# Altium project PPS_V2.PrjPcb
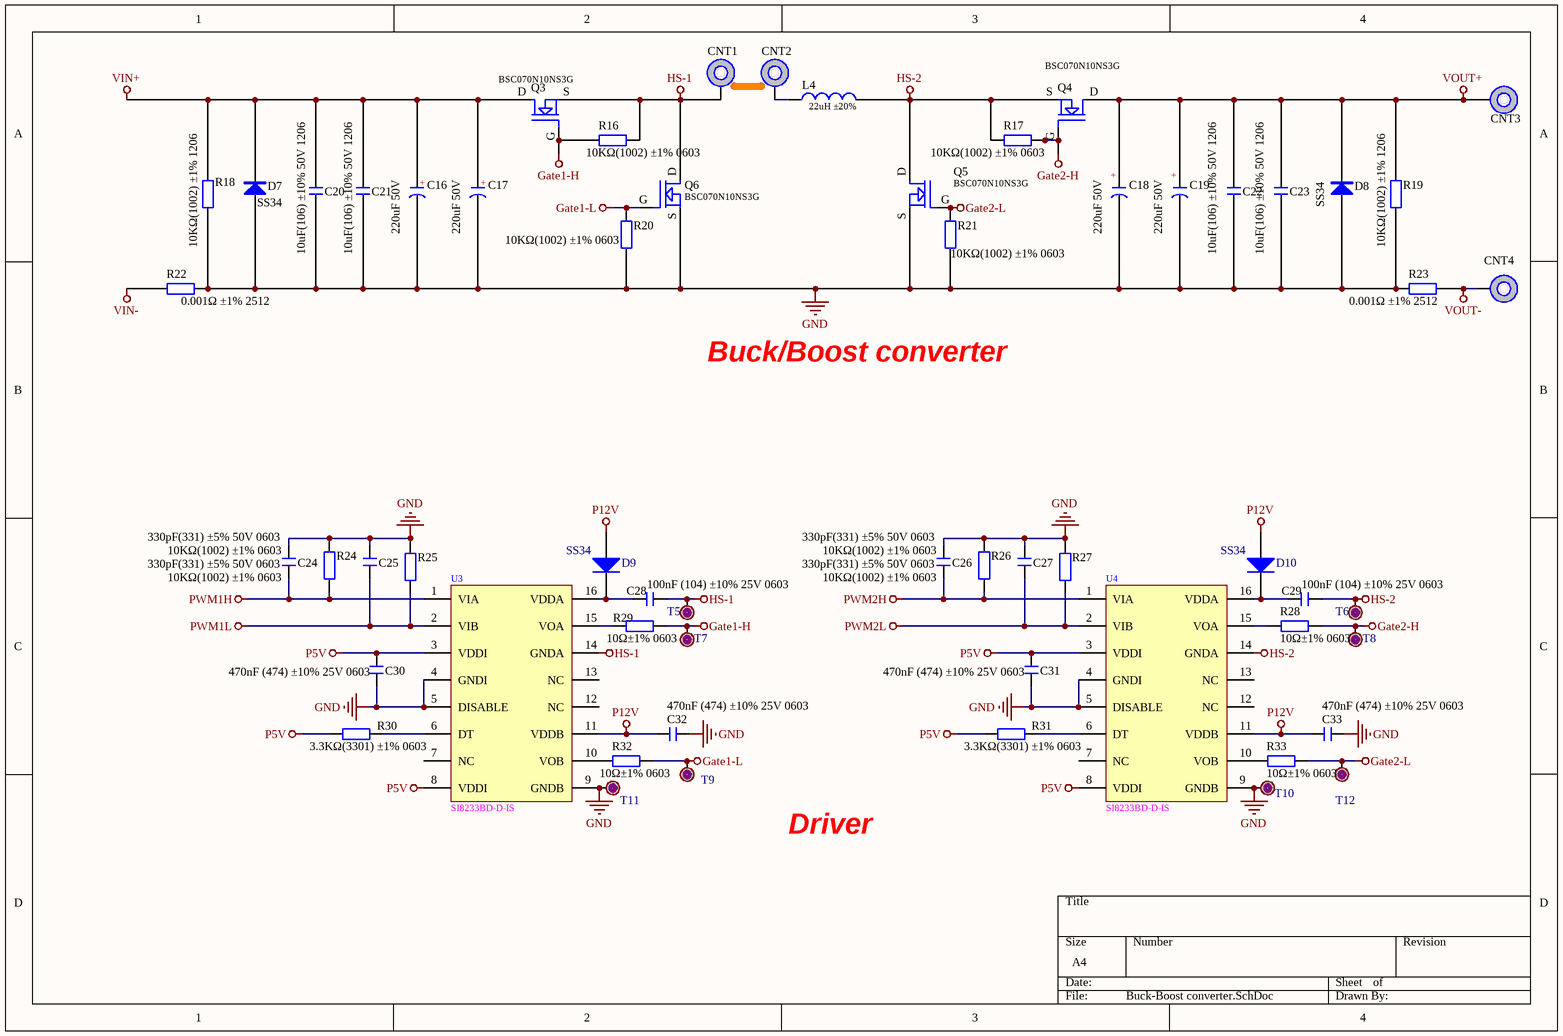
[diagram p0: Buck-Boost converter.SchDoc]
4 sheets, 172 parts. Net scope: global (net labels, ports and power ports of the same name join across sheets).
Sheets:
  Buck-Boost converter.SchDoc
  Power management.SchDoc
  Sampling.SchDoc
  Control.SchDoc

## Sheet Buck-Boost converter.SchDoc
size A4; SheetNumber: 1; SheetTotal: 4

### Parts
C16  220uF 50V  [CE F(10*10.2)]
C17  220uF 50V  [CE F(10*10.2)]
C18  220uF 50V  [CE F(10*10.2)]
C19  220uF 50V  [CE F(10*10.2)]
C20  10uF(106) ±10% 50V 1206  [C 1206_M]
C21  10uF(106) ±10% 50V 1206  [C 1206_M]
C22  10uF(106) ±10% 50V 1206  [C 1206_M]
C23  10uF(106) ±10% 50V 1206  [C 1206_M]
C24  330pF(331) ±5% 50V 0603  [C 0603_L]
C25  330pF(331) ±5% 50V 0603  [C 0603_L]
C26  330pF(331) ±5% 50V 0603  [C 0603_L]
C27  330pF(331) ±5% 50V 0603  [C 0603_L]
C28  100nF (104) ±10% 25V 0603  [C 0603_L]
C29  100nF (104) ±10% 25V 0603  [C 0603_L]
C30  470nF (474) ±10% 25V 0603  [C 0603_L]
C31  470nF (474) ±10% 25V 0603  [C 0603_L]
C32  470nF (474) ±10% 25V 0603  [C 0603_L]
C33  470nF (474) ±10% 25V 0603  [C 0603_L]
CNT1  CST  [M3]  (value not drawn)
CNT2  CST  [M3]  (value not drawn)
CNT3  CST  [M3]  (value not drawn)
CNT4  CST  [M3]  (value not drawn)
D7  SS34  [SMA]
D8  SS34  [SMA]
D9  SS34  [SMA]
D10  SS34  [SMA]
L4  22uH ±20%  [L-SMD-0630]
Q3  BSC070N10NS3G  [PG-TDSON-8_5x6MM]
Q4  BSC070N10NS3G  [PG-TDSON-8_5x6MM]
Q5  BSC070N10NS3G  [PG-TDSON-8_5x6MM]
Q6  BSC070N10NS3G  [PG-TDSON-8_5x6MM]
R16  10KΩ(1002) ±1% 0603  [R 0603_L]
R17  10KΩ(1002) ±1% 0603  [R 0603_L]
R18  10KΩ(1002) ±1% 1206  [R 1206_L]
R19  10KΩ(1002) ±1% 1206  [R 1206_L]
R20  10KΩ(1002) ±1% 0603  [R 0603_L]
R21  10KΩ(1002) ±1% 0603  [R 0603_L]
R22  0.001Ω ±1% 2512  [R2512]
R23  0.001Ω ±1% 2512  [R2512]
R24  10KΩ(1002) ±1% 0603  [R 0603_L]
R25  10KΩ(1002) ±1% 0603  [R 0603_L]
R26  10KΩ(1002) ±1% 0603  [R0805_L]
R27  10KΩ(1002) ±1% 0603  [R 0603_L]
R28  10Ω±1% 0603  [R 0603_L]
R29  10Ω±1% 0603  [R 0603_L]
R30  3.3KΩ(3301) ±1% 0603  [R 0603_L]
R31  3.3KΩ(3301) ±1% 0603  [R 0603_L]
R32  10Ω±1% 0603  [R 0603_L]
R33  10Ω±1% 0603  [R 0603_L]
T5  TestP  [TestP]  (value not drawn)
T6  TestP  [TestP]  (value not drawn)
T7  TestP  [TestP]  (value not drawn)
T8  TestP  [TestP]  (value not drawn)
T9  TestP  [TestP]  (value not drawn)
T10  TestP  [TestP]  (value not drawn)
T11  TestP  [TestP]  (value not drawn)
T12  TestP  [TestP]  (value not drawn)
U3  SI8233BD-D-IS  [SOJ16T]
U4  SI8233BD-D-IS  [SOJ16T]

### Nets
Gate1-H: Q3.G(GATE) R16.1 R29.1 T7.0
Gate1-L: Q6.G(GATE) R20.2 R32.1 T9.0
Gate2-H: Q4.G(GATE) R17.1 R28.1 T8.0
Gate2-L: Q5.G(GATE) R21.2 R33.1 T12.0
GND: C16.2(K) C17.2(K) C18.2(K) C19.2(K) C20.1 C21.1 C22.1 C23.1 C24.2 C25.2 C26.2 C27.2 C30.2 C31.2 C32.1 C33.1 D7.1(A) D8.1(A) Q5.S(SOURCE) Q6.S(SOURCE) R18.1 R19.1 R20.1 R21.1 R22.1 R23.1 R24.2 R25.2 R26.2 R27.2 T10.0 T11.0 U3.4(GNDI) U3.5(DISABLE) U3.9(GNDB) U4.4(GNDI) U4.5(DISABLE) U4.9(GNDB)
HS-1: C28.2 CNT1.1 Q3.S(SOURCE) Q6.D(DRAIN) R16.2 T5.0 U3.14(GNDA)
HS-2: C29.2 L4.2 Q4.S(SOURCE) Q5.D(DRAIN) R17.2 T6.0 U4.14(GNDA)
P5V: C30.1 C31.1 R30.2 R31.2 U3.3(VDDI) U3.8(VDDI) U4.3(VDDI) U4.8(VDDI)
P12V: C32.2 C33.2 D9.1(A) D10.1(A) U3.11(VDDB) U4.11(VDDB)
PWM1H: C24.1 R24.1 U3.1(VIA)
PWM1L: C25.1 R25.1 U3.2(VIB)
PWM2H: C26.1 R26.1 U4.1(VIA)
PWM2L: C27.1 R27.1 U4.2(VIB)
VIN+: C16.1(A) C17.1(A) C20.2 C21.2 D7.2(K) Q3.D(DRAIN) R18.2
VIN-: R22.2
VOUT+: C18.1(A) C19.1(A) C22.2 C23.2 CNT3.1 D8.2(K) Q4.D(DRAIN) R19.2
VOUT-: CNT4.1 R23.2
NetC28_1: C28.1 D9.2(K) U3.16(VDDA)
NetC29_1: C29.1 D10.2(K) U4.16(VDDA)
NetCNT2_1: CNT2.1 L4.1
NetR28_2: R28.2 U4.15(VOA)
NetR29_2: R29.2 U3.15(VOA)
NetR30_1: R30.1 U3.6(DT)
NetR31_1: R31.1 U4.6(DT)
NetR32_2: R32.2 U3.10(VOB)
NetR33_2: R33.2 U4.10(VOB)

Not connected (* = marked no-connect by the designer): U3 7(NC) 12(NC) 13(NC); U4 7(NC) 12(NC) 13(NC)

### Notes on the sheet
- Buck/Boost converter
- Driver
- (in symbol CE) +

### Library data of the parts
C16-C19 = CE: 直插电解电容
C20-C33 = C: 贴片电容; BOM名称: 无极性贴片电容; 淘宝ID: 封装库来自淘宝 ID：黄晶宝石; 联系售后，技术支持: https://shop463601444.taobao.com; 唯一出售店铺网址: https://shop463601444.taobao.com
CNT1-CNT4 = SO3040
D7 D8 = 1N4007: 整流二极管; 淘宝ID: 封装库来自淘宝 ID：黄晶宝石; 封装库来自淘宝卖家 ID：黄晶宝石: 其他店铺购入均为盗版，不享受售后技术支持服务，请立即申请退款; BOM名称: 整流二极管; 联系售后，技术支持: https://shop463601444.taobao.com
D9 D10 = Diode: Default Diode
L4 = Inductor
Q3-Q6 = MOSFET N
R16-R33 = R: 贴片电阻; 版权归属: 来自淘宝 ID：黄晶宝石; 封装库来自淘宝卖家 ID：黄晶宝石: 其他店铺购入均为盗版，不享受售后技术支持服务，请立即申请退款; BOM名称: 贴片电阻; 联系售后: https://shop463601444.taobao.com
U3 U4 = Si8233

## Sheet Power management.SchDoc
size A4; SheetNumber: 2; SheetTotal: 4
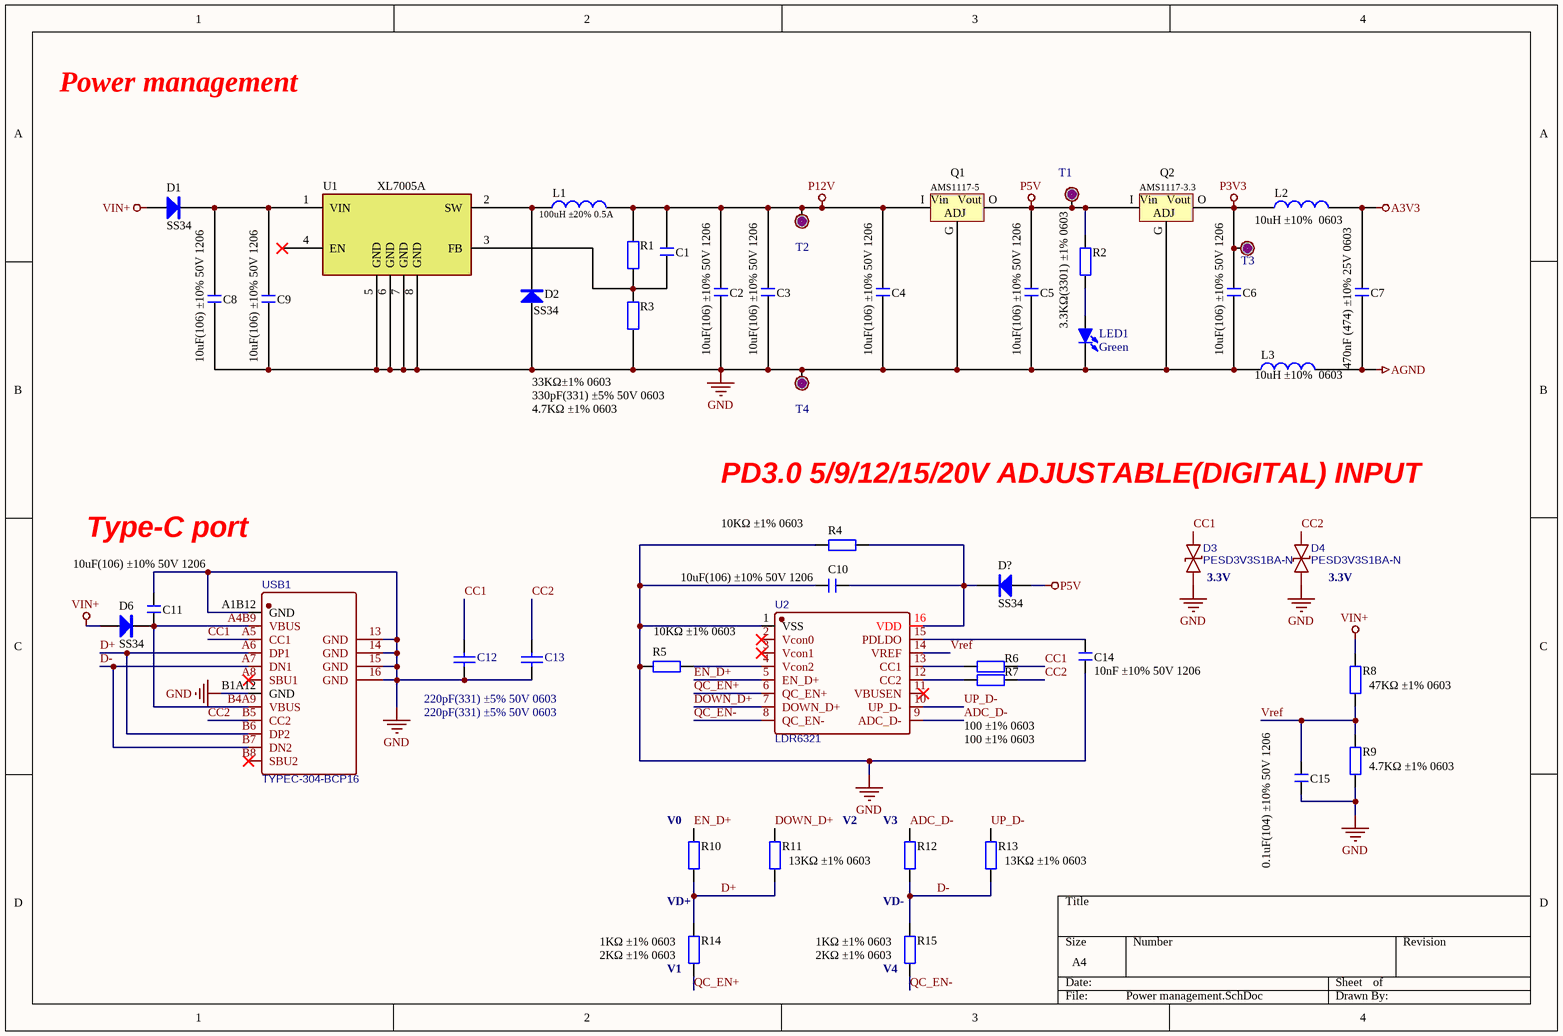
[diagram p1: Power management.SchDoc]

### Parts
C1  330pF(331) ±5% 50V 0603  [C 0603_L]
C2  10uF(106) ±10% 50V 1206  [C 1206_M]
C3  10uF(106) ±10% 50V 1206  [C 1206_M]
C4  10uF(106) ±10% 50V 1206  [C 1206_M]
C5  10uF(106) ±10% 50V 1206  [C 1206_M]
C6  10uF(106) ±10% 50V 1206  [C 1206_M]
C7  470nF (474) ±10% 25V 0603  [C 0603_L]
C8  10uF(106) ±10% 50V 1206  [C 1206_M]
C9  10uF(106) ±10% 50V 1206  [C 1206_M]
C10  10uF(106) ±10% 50V 1206  [C 1206_M]
C11  10uF(106) ±10% 50V 1206  [C 1206_M]
C12  220pF(331) ±5% 50V 0603  [C0603_L]
C13  220pF(331) ±5% 50V 0603  [C0603_L]
C14  10nF ±10% 50V 1206  [C 1206_M]
C15  0.1uF(104) ±10% 50V 1206  [C 1206_M]
D1  SS34  [SMA]
D2  SS34  [SMA]
D3  PESD3V3S1BA-N  [SOD-523_L1.2-W0.8-LS1.6-BI]
D4  PESD3V3S1BA-N  [SOD-523_L1.2-W0.8-LS1.6-BI]
D6  SS34  [SMA]
D?  SS34  [SMA]
L1  100uH ±20% 0.5A  [CDRH74]
L2  10uH ±10%  0603  [L 0603]
L3  10uH ±10%  0603  [L 0603]
LED1  Green  [LED 0603R]
Q1  AMS1117-5  [SOT-223]
Q2  AMS1117-3.3  [SOT-223]
R1  33KΩ±1% 0603  [R 0603_L]
R2  3.3KΩ(3301) ±1% 0603  [R 0603_L]
R3  4.7KΩ ±1% 0603  [R 0603_L]
R4  10KΩ ±1% 0603  [R 0603_L]
R5  10KΩ ±1% 0603  [R 0603_L]
R6  100 ±1% 0603  [R 0603_L]
R7  100 ±1% 0603  [R 0603_L]
R8  47KΩ ±1% 0603  [R 0603_L]
R9  4.7KΩ ±1% 0603  [R 0603_L]
R10  1KΩ ±1% 0603  [R 0603_L]
R11  13KΩ ±1% 0603  [R 0603_L]
R12  1KΩ ±1% 0603  [R 0603_L]
R13  13KΩ ±1% 0603  [R 0603_L]
R14  2KΩ ±1% 0603  [R 0603_L]
R15  2KΩ ±1% 0603  [R 0603_L]
T1  TestP  [TestP]  (value not drawn)
T2  TestP  [TestP]  (value not drawn)
T3  TestP  [TestP]  (value not drawn)
T4  TestP  [TestP]  (value not drawn)
U1  XL7005A  [SOP8-EP]
U2  LDR6321  [SSOP-16_L5.0-W4.4-P0.65-LS6.4-BL]
USB1  TYPEC-304-BCP16  [USB-C-SMD_TYPEC-304-BCP16]

### Nets
A3V3: C7.1 L2.2
AGND: C7.2 L3.2
GND: C2.1 C3.1 C4.1 C5.1 C6.1 C8.1 C9.1 C10.2 C11.2 C12.1 C13.1 C14.1 C15.1 D2.1(A) D3.1 D4.1 L3.1 LED1.2(K) Q1.G Q2.G R3.2 R4.1 R5.1 R9.1 T4.0 U1.5(GND) U1.6(GND) U1.7(GND) U1.8(GND) U2.1(VSS) USB1.13(GND) USB1.14(GND) USB1.15(GND) USB1.16(GND) USB1.A1B12(GND) USB1.B1A12(GND)
P3V3: C6.2 L2.1 Q2.O(OUT) T3.0
P5V: C5.2 D?.1(A) Q1.O(OUT) Q2.I(IN) R2.1 T1.0
P12V: C1.2 C2.2 C3.2 C4.2 L1.2 Q1.I(IN) R1.1 T2.0
VIN+: D1.1(A) D6.1(A) R8.2
ADC_D-: R12.2 U2.9(ADC_D-)
CC1: C12.2 D3.2 R6.2 USB1.A5(CC1)
CC2: C13.2 D4.2 R7.2 USB1.B5(CC2)
D+: R10.1 R11.1 R14.2 USB1.A6(DP1) USB1.B6(DP2)
D-: R12.1 R13.1 R15.2 USB1.A7(DN1) USB1.B7(DN2)
DOWN_D+: R11.2 U2.7(DOWN_D+)
EN_D+: R10.2 U2.5(EN_D+)
QC_EN+: R14.1 U2.6(QC_EN+)
QC_EN-: R15.1 U2.8(QC_EN-)
UP_D-: R13.2 U2.10(UP_D-)
Vref: C15.2 R8.1 R9.2 U2.14(VREF)
NetC1_1: C1.1 R1.2 R3.1 U1.3(FB)
NetC8_2: C8.2 C9.2 D1.2(K) U1.1(VIN)
NetC10_1: C10.1 D?.2(K) R4.2 U2.16(VDD)
NetC11_1: C11.1 D6.2(K) USB1.A4B9(VBUS) USB1.B4A9(VBUS)
NetC14_2: C14.2 U2.15(PDLDO)
NetD2_2: D2.2(K) L1.1 U1.2(SW)
NetLED1_1: LED1.1(A) R2.2
NetR5_2: R5.2 U2.4(Vcon2)
NetR6_1: R6.1 U2.13(CC1)
NetR7_1: R7.1 U2.12(CC2)

Not connected (* = marked no-connect by the designer): U1 4(EN)*; U2 2(Vcon0)* 3(Vcon1)* 11(VBUSEN)*; USB1 A8(SBU1)* B8(SBU2)*

### Notes on the sheet
- Power management
- PD3.0 5/9/12/15/20V ADJUSTABLE(DIGITAL) INPUT
- Type-C port
- (near D3) 3.3V
- (near D4) 3.3V
- (near R10) V0
- V2
- (near R12) V3
- VD+
- VD-
- (near R14) V1
- (near R15) V4
- (in symbol NCP1117ST50T3G) Vin; Vout; ADJ

### Library data of the parts
C1-C11 C14 C15 = C: as C20 on sheet Buck-Boost converter; 联系售后，技术支持: https://shop463601444.taobao.com; 唯一出售店铺网址: https://shop463601444.taobao.com
C12 C13 = C: 贴片电容/MLCC电容; BOM名称: 无极性贴片电容; 联系卖家，免费查找封装: 唯一出售店铺网址https://shop463601444.taobao.com
D1 D2 D6 D? = 1N4007: as D7 on sheet Buck-Boost converter; BOM名称: 整流二极管; 联系售后，技术支持: https://shop463601444.taobao.com
D3 D4 = PESD3V3S1BA-N: TVS3V3; BOM_Manufacturer: Bourne Semicon (Shenzhen); Contributor: LCSC; BOM_Supplier: LCSC; BOM_Supplier Part: C316037; BOM_Manufacturer Part: PESD3V3S1BA-N; BOM_JLCPCB Part Class: Extended Part; spicePre: D; spiceSymbolName: PESD3V3S1BA-N
L1 = Inductor
L2 L3 = L: 小功率贴片电感; 淘宝ID: 封装库来自淘宝 ID：黄晶宝石; 封装库来自淘宝卖家 ID：黄晶宝石: 其他店铺购入均为盗版，不享受售后技术支持服务，请立即申请退款; BOM名称: 小功率贴片电感; 联系售后: https://shop463601444.taobao.com
LED1 = LED-SMD: 贴片LED; 版权归属: 封装库来自淘宝 ID：黄晶宝石; BOM名称: 贴片LED; 学习资源: https://shop463601444.taobao.com
Q1 Q2 = NCP1117ST50T3G
R1-R15 = R: as R16 on sheet Buck-Boost converter; BOM名称: 贴片电阻; 联系售后: https://shop463601444.taobao.com
U2 = LDR6321: BOM_Manufacturer: Legendary(乐得瑞); Contributor: LCSC; BOM_Supplier: LCSC; BOM_Supplier Part: C2919632; BOM_Manufacturer Part: LDR6321; BOM_JLCPCB Part Class: Extended Part; spicePre: U; spiceSymbolName: LDR6321
USB1 = TYPEC-304-BCP16: BOM_Manufacturer: XUNPU; Contributor: LCSC; BOM_Supplier: LCSC; BOM_Supplier Part: C720629; BOM_Manufacturer Part: TYPEC-304-BCP16; BOM_JLCPCB Part Class: Extended Part; spicePre: U; spiceSymbolName: TYPEC-304-BCP16

## Sheet Sampling.SchDoc
size A4; SheetNumber: 2; SheetTotal: 3
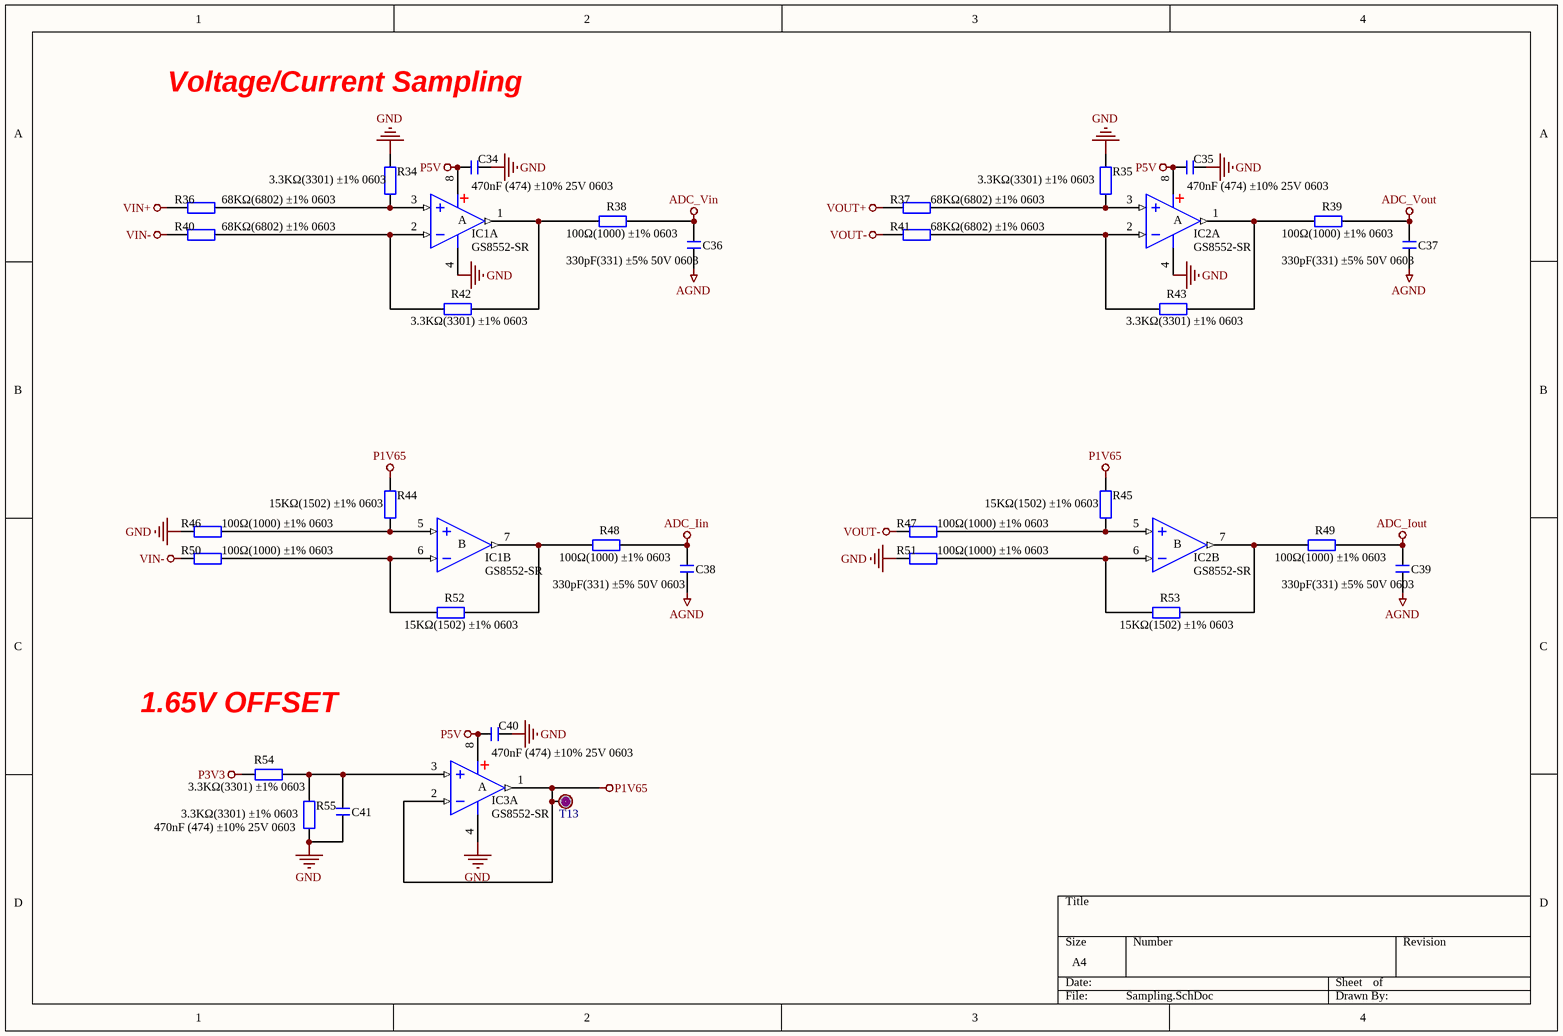
[diagram p2: Sampling.SchDoc]

### Parts
C34  470nF (474) ±10% 25V 0603  [C 0603_L]
C35  470nF (474) ±10% 25V 0603  [C 0603_L]
C36  330pF(331) ±5% 50V 0603  [C 0603_L]
C37  330pF(331) ±5% 50V 0603  [C 0603_L]
C38  330pF(331) ±5% 50V 0603  [C 0603_L]
C39  330pF(331) ±5% 50V 0603  [C 0603_L]
C40  470nF (474) ±10% 25V 0603  [C 0603_L]
C41  470nF (474) ±10% 25V 0603  [C 0603_L]
IC1  GS8552-SR  [SOP8_N]  (parts A,B of 2)
IC2  GS8552-SR  [SOP8_N]  (parts A,B of 2)
IC3  GS8552-SR  [SOP8_N]  (part A of 2)
R34  3.3KΩ(3301) ±1% 0603  [R 0603_L]
R35  3.3KΩ(3301) ±1% 0603  [R 0603_L]
R36  68KΩ(6802) ±1% 0603  [R 0603_L]
R37  68KΩ(6802) ±1% 0603  [R 0603_L]
R38  100Ω(1000) ±1% 0603  [R 0603_L]
R39  100Ω(1000) ±1% 0603  [R 0603_L]
R40  68KΩ(6802) ±1% 0603  [R 0603_L]
R41  68KΩ(6802) ±1% 0603  [R 0603_L]
R42  3.3KΩ(3301) ±1% 0603  [R 0603_L]
R43  3.3KΩ(3301) ±1% 0603  [R 0603_L]
R44  15KΩ(1502) ±1% 0603  [R 0603_L]
R45  15KΩ(1502) ±1% 0603  [R 0603_L]
R46  100Ω(1000) ±1% 0603  [R 0603_L]
R47  100Ω(1000) ±1% 0603  [R 0603_L]
R48  100Ω(1000) ±1% 0603  [R 0603_L]
R49  100Ω(1000) ±1% 0603  [R 0603_L]
R50  100Ω(1000) ±1% 0603  [R 0603_L]
R51  100Ω(1000) ±1% 0603  [R 0603_L]
R52  15KΩ(1502) ±1% 0603  [R 0603_L]
R53  15KΩ(1502) ±1% 0603  [R 0603_L]
R54  3.3KΩ(3301) ±1% 0603  [R 0603_L]
R55  3.3KΩ(3301) ±1% 0603  [R 0603_L]
T13  TestP  [TestP]  (value not drawn)

### Nets
ADC_Iin: C38.2 R48.2
ADC_Iout: C39.2 R49.2
ADC_Vin: C36.2 R38.2
ADC_Vout: C37.2 R39.2
AGND: C36.1 C37.1 C38.1 C39.1
GND: C34.1 C35.1 C40.1 C41.2 IC1.4(V-) IC2.4(V-) IC3.4(V-) R34.2 R35.2 R46.1 R51.1 R55.2
P1V65: IC3.1(OUT) IC3.2(IN-) R44.2 R45.2 T13.0
P3V3: R54.2
P5V: C34.2 C35.2 C40.2 IC1.8(V+) IC2.8(V+) IC3.8(V+)
VIN+: R36.1
VIN-: R40.1 R50.1
VOUT+: R37.1
VOUT-: R41.1 R47.1
NetC41_1: C41.1 IC3.3(IN+) R54.1 R55.1
NetIC1_1: IC1.1(OUT) R38.1 R42.2
NetIC1_2: IC1.2(IN-) R40.2 R42.1
NetIC1_3: IC1.3(IN+) R34.1 R36.2
NetIC1_5: IC1.5(IN+) R44.1 R46.2
NetIC1_6: IC1.6(IN-) R50.2 R52.1
NetIC1_7: IC1.7(OUT) R48.1 R52.2
NetIC2_1: IC2.1(OUT) R39.1 R43.2
NetIC2_2: IC2.2(IN-) R41.2 R43.1
NetIC2_3: IC2.3(IN+) R35.1 R37.2
NetIC2_5: IC2.5(IN+) R45.1 R47.2
NetIC2_6: IC2.6(IN-) R51.2 R53.1
NetIC2_7: IC2.7(OUT) R49.1 R53.2

### Notes on the sheet
- Voltage/Current Sampling
- 1.65V OFFSET
- (in symbol LM358, part A) A
- (in symbol LM358, part B) B

### Library data of the parts
C34-C41 = C: as C20 on sheet Buck-Boost converter; 联系售后，技术支持: https://shop463601444.taobao.com; 唯一出售店铺网址: https://shop463601444.taobao.com
IC1-IC3 = LM358: 双路运放; 版权归属: 源创客; BOM名称: 双路运放; 封装库来自淘宝 ID：黄晶宝石: https://shop463601444.taobao.com
R34-R55 = R: as R16 on sheet Buck-Boost converter; BOM名称: 贴片电阻; 联系售后: https://shop463601444.taobao.com

## Sheet Control.SchDoc
size A4; SheetNumber: 4; SheetTotal: 4
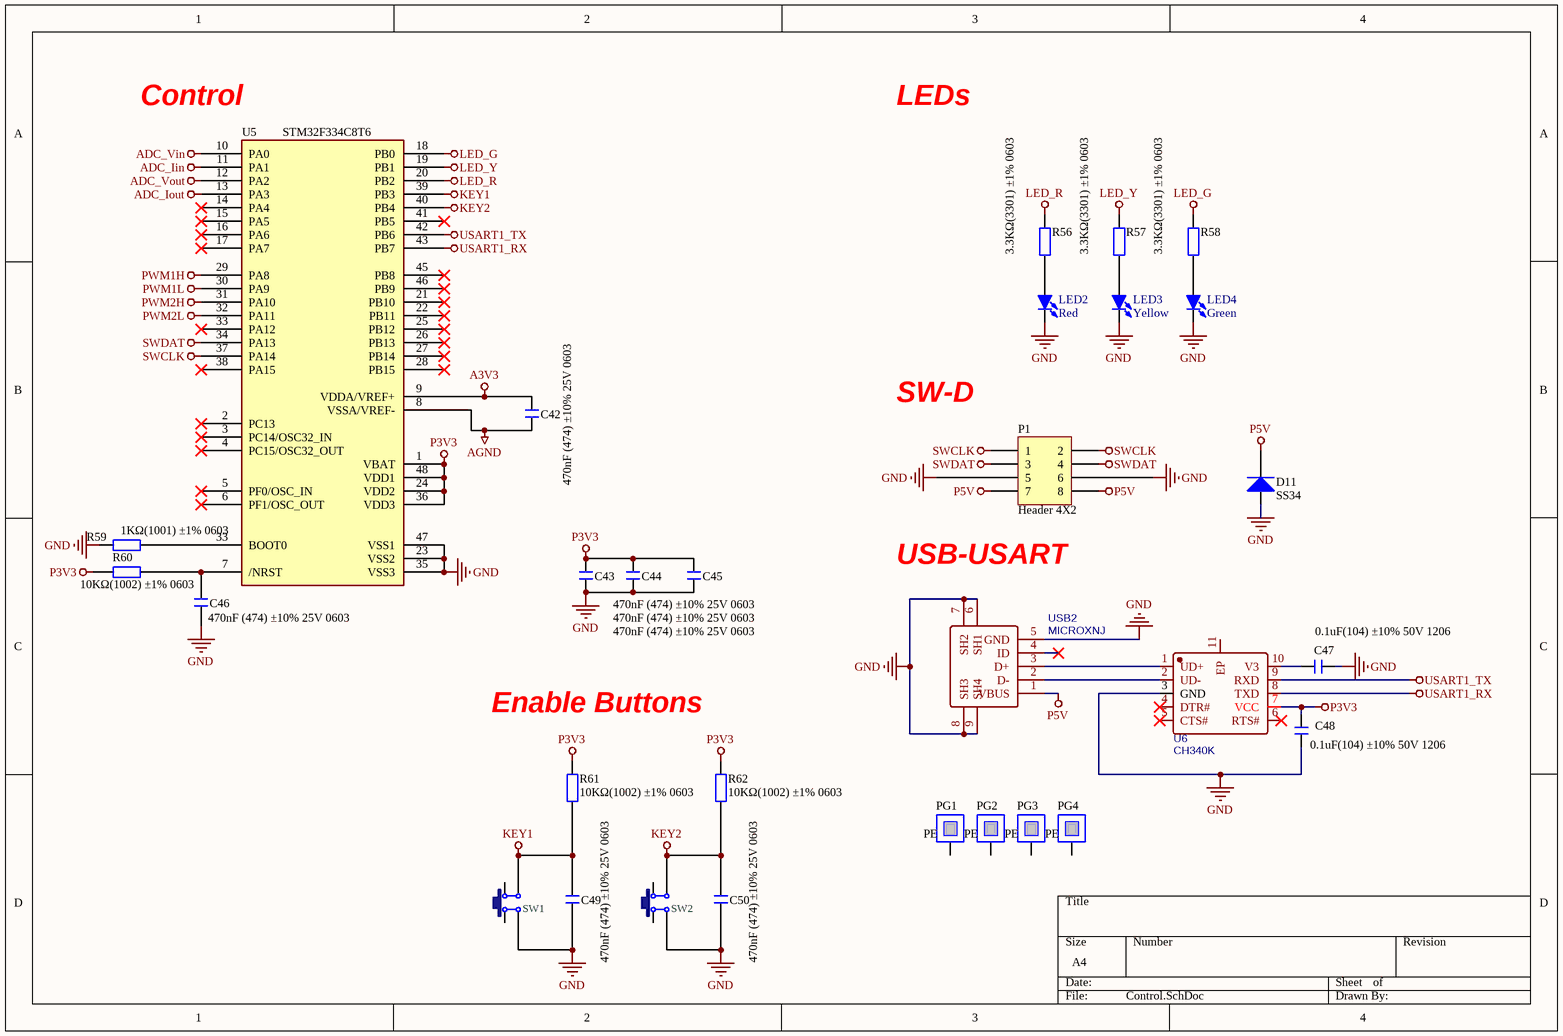
[diagram p3: Control.SchDoc]

### Parts
C42  470nF (474) ±10% 25V 0603  [C 0603_L]
C43  470nF (474) ±10% 25V 0603  [C 0603_L]
C44  470nF (474) ±10% 25V 0603  [C 0603_L]
C45  470nF (474) ±10% 25V 0603  [C 0603_L]
C46  470nF (474) ±10% 25V 0603  [C 0603_L]
C47  0.1uF(104) ±10% 50V 1206  [C 1206_M]
C48  0.1uF(104) ±10% 50V 1206  [C 1206_M]
C49  470nF (474) ±10% 25V 0603  [C 0603_L]
C50  470nF (474) ±10% 25V 0603  [C 0603_L]
D11  SS34  [SMA]
LED2  Red  [LED 0603R]
LED3  Yellow  [LED 0603R]
LED4  Green  [LED 0603R]
P1  Header 4X2  [HDR2.54-LI-2x4P]
PG1  PE  [FG-M3]  (no BOM)
PG2  PE  [FG-M3]  (no BOM)
PG3  PE  [FG-M3]  (no BOM)
PG4  PE  [FG-M3]  (no BOM)
R56  3.3KΩ(3301) ±1% 0603  [R 0603_L]
R57  3.3KΩ(3301) ±1% 0603  [R 0603_L]
R58  3.3KΩ(3301) ±1% 0603  [R 0603_L]
R59  1KΩ(1001) ±1% 0603  [R 0603_L]
R60  10KΩ(1002) ±1% 0603  [R 0603_L]
R61  10KΩ(1002) ±1% 0603  [R 0603_L]
R62  10KΩ(1002) ±1% 0603  [R 0603_L]
SW1  6x6x5  [TSW SMD-6*6*7]  (value not drawn)
SW2  6x6x5  [TSW SMD-6*6*7]  (value not drawn)
U5  STM32F334C8T6  [LQFP48-7*7]
U6  CH340K  [ESOP-10_L4.9-W3.9-P1.00-LS6.2-BL-EP]
USB2  MICROXNJ  [MICRO-USB-SMD_MICROXNJ]

### Nets
A3V3: C42.2 U5.9(VDDA/VREF+)
ADC_Iin: U5.11(PA1)
ADC_Iout: U5.13(PA3)
ADC_Vin: U5.10(PA0)
ADC_Vout: U5.12(PA2)
AGND: C42.1 U5.8(VSSA/VREF-)
GND: C43.1 C44.1 C45.1 C46.1 C47.1 C48.2 C49.1 C50.1 D11.1(A) LED2.2(K) LED3.2(K) LED4.2(K) P1.5 P1.6 R59.1 SW1.4 SW2.4 U5.23(VSS2) U5.35(VSS3) U5.47(VSS1) U6.3(GND) USB2.5(GND) USB2.6(SH1) USB2.7(SH2) USB2.8(SH3) USB2.9(SH4)
KEY1: C49.2 R61.1 SW1.3 U5.39(PB3)
KEY2: C50.2 R62.1 SW2.3 U5.40(PB4)
LED_G: R58.2 U5.18(PB0)
LED_R: R56.2 U5.20(PB2)
LED_Y: R57.2 U5.19(PB1)
P3V3: C43.2 C44.2 C45.2 C48.1 R60.1 R61.2 R62.2 U5.1(VBAT) U5.24(VDD2) U5.36(VDD3) U5.48(VDD1) U6.7(VCC)
P5V: D11.2(K) P1.7 P1.8 USB2.1(VBUS)
PWM1H: U5.29(PA8)
PWM1L: U5.30(PA9)
PWM2H: U5.31(PA10)
PWM2L: U5.32(PA11)
SWCLK: P1.1 P1.2 U5.37(PA14)
SWDAT: P1.3 P1.4 U5.34(PA13)
USART1_RX: U5.43(PB7) U6.8(TXD)
USART1_TX: U5.42(PB6) U6.9(RXD)
NetC46_2: C46.2 R60.2 U5.7(/NRST)
NetC47_2: C47.2 U6.10(V3)
NetLED2_1: LED2.1(A) R56.1
NetLED3_1: LED3.1(A) R57.1
NetLED4_1: LED4.1(A) R58.1
NetR59_2: R59.2 U5.33(PA12)
NetU6_1: U6.1(UD+) USB2.3(D+)
NetU6_2: U6.2(UD-) USB2.2(D-)

Not connected (* = marked no-connect by the designer): PG1 1; PG2 1; PG3 1; PG4 1; SW1 1 2; SW2 1 2; U5 2(PC13)* 3(PC14/OSC32_IN)* 4(PC15/OSC32_OUT)* 5(PF0/OSC_IN)* 6(PF1/OSC_OUT)* 14(PA4)* 15(PA5)* 16(PA6)* 17(PA7)* 21(PB10)* 22(PB11)* 25(PB12)* 26(PB13)* 27(PB14)* 28(PB15)* 38(PA15)* 41(PB5)* 45(PB8)* 46(PB9)*; U6 4(DTR#)* 5(CTS#)* 6(RTS#)* 11(EP); USB2 4(ID)*

### Notes on the sheet
- (near U5) Control
- LEDs
- SW-D
- USB-USART
- Enable Buttons

### Library data of the parts
C42-C50 = C: as C20 on sheet Buck-Boost converter; 联系售后，技术支持: https://shop463601444.taobao.com; 唯一出售店铺网址: https://shop463601444.taobao.com
D11 = Diode: Default Diode
LED2-LED4 = LED-SMD: 贴片LED; 版权归属: 封装库来自淘宝 ID：黄晶宝石; BOM名称: 贴片LED; 学习资源: https://shop463601444.taobao.com
P1 = Header 4X2: Header, 4-Pin, Dual row; LatestRevisionDate: 17-Jul-2002; LatestRevisionNote: Re-released for DXP Platform.; Publisher: Altium Limited
PG1-PG4 = H-SINK
R56-R62 = R: as R16 on sheet Buck-Boost converter; BOM名称: 贴片电阻; 联系售后: https://shop463601444.taobao.com
SW1 SW2 = TSW DIP-6x6: 直插6x6轻触开关; 版权归属: 封装库来自淘宝 ID：黄晶宝石; BOM名称: 直插6x6轻触开关; 唯一出售店铺网址: https://shop463601444.taobao.com
U6 = CH340K: BOM_Manufacturer: WCH(Jiangsu Qin Heng); Contributor: LCSC; BOM_Supplier: LCSC; BOM_Supplier Part: C968586; BOM_Manufacturer Part: CH340K; BOM_JLCPCB Part Class: Extended Part; spicePre: U; spiceSymbolName: CH340K
USB2 = MICROXNJ: BOM_Manufacturer: SHOU HAN; Contributor: LCSC; BOM_Supplier: LCSC; BOM_Supplier Part: C404969; BOM_Manufacturer Part: MicroXNJ; BOM_JLCPCB Part Class: Extended Part; spicePre: U; spiceSymbolName: MICROXNJ

## Nets that join several sheets
A3V3: Power management (C7.1 L2.2), Control (C42.2 U5.9)
ADC_Iin: Sampling (C38.2 R48.2), Control (U5.11)
ADC_Iout: Sampling (C39.2 R49.2), Control (U5.13)
ADC_Vin: Sampling (C36.2 R38.2), Control (U5.10)
ADC_Vout: Sampling (C37.2 R39.2), Control (U5.12)
AGND: Power management (C7.2 L3.2), Sampling (C36.1 C37.1 C38.1 C39.1), Control (C42.1 U5.8)
GND: Buck-Boost converter (38 pins), Power management (36 pins), Sampling (12 pins), Control (26 pins)
P3V3: Power management (C6.2 L2.1 Q2.O T3.0), Sampling (R54.2), Control (12 pins)
P5V: Buck-Boost converter (8 pins), Power management (6 pins), Sampling (6 pins), Control (D11.2 P1.7 P1.8 USB2.1)
P12V: Buck-Boost converter (6 pins), Power management (8 pins)
PWM1H: Buck-Boost converter (C24.1 R24.1 U3.1), Control (U5.29)
PWM1L: Buck-Boost converter (C25.1 R25.1 U3.2), Control (U5.30)
PWM2H: Buck-Boost converter (C26.1 R26.1 U4.1), Control (U5.31)
PWM2L: Buck-Boost converter (C27.1 R27.1 U4.2), Control (U5.32)
VIN+: Buck-Boost converter (7 pins), Power management (D1.1 D6.1 R8.2), Sampling (R36.1)
VIN-: Buck-Boost converter (R22.2), Sampling (R40.1 R50.1)
VOUT+: Buck-Boost converter (8 pins), Sampling (R37.1)
VOUT-: Buck-Boost converter (CNT4.1 R23.2), Sampling (R41.1 R47.1)